# EAGLE design power_sense_shield (EAGLE 6.3)
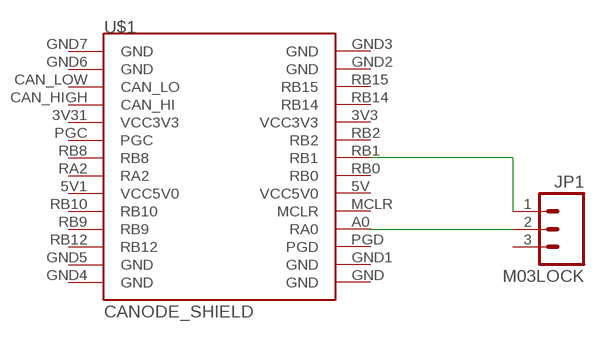
[diagram p0: schematic, sheet 1]

## Parts
JP1  M03LOCK  [1X03_LOCK]
U$1  CANODE_SHIELD  [CANODE_SHIELD]

## Nets
N$2: JP1.2 U$1.A0(RA0)
N$3 [small]: JP1.1 U$1.RB1
Unconnected: JP1.3 U$1.3V3(VCC3V3) U$1.3V31(VCC3V3) U$1.5V1(VCC5V0) U$1.5V(VCC5V0) U$1.CAN_HIGH(CAN_HI) U$1.CAN_LOW(CAN_LO) U$1.GND U$1.GND1(GND) U$1.GND2(GND) U$1.GND3(GND) U$1.GND4(GND) U$1.GND5(GND) U$1.GND6(GND) U$1.GND7(GND) U$1.MCLR U$1.PGC U$1.PGD U$1.RA2 U$1.RB0 U$1.RB2 U$1.RB8 U$1.RB9 U$1.RB10 U$1.RB12 U$1.RB14 U$1.RB15

## Library data of the parts
JP1 = ASL:M03: Header 3 Standard 3-pin 0.1" header. Use with straight break away headers (SKU : PRT-00116), right angle break away headers (PRT-00553), swiss pins (PRT-00743), machine pins (PRT-00117), and female headers (PRT-00115). Molex polarized connector foot print use with SKU : PRT-08232 with associated crimp pins and housings.
U$1 = ASL:CANODE_SHIELD: This part provides an outline of the CANode to facilitate developing shield boards. Note that this does not show the position of the mounting holes for the 4-40 screws, which should be .12" holes centered in the 4 circles in the corners.

## Net classes
1 power: width 0.762 mm
2 small: width 0.203 mm

## Board
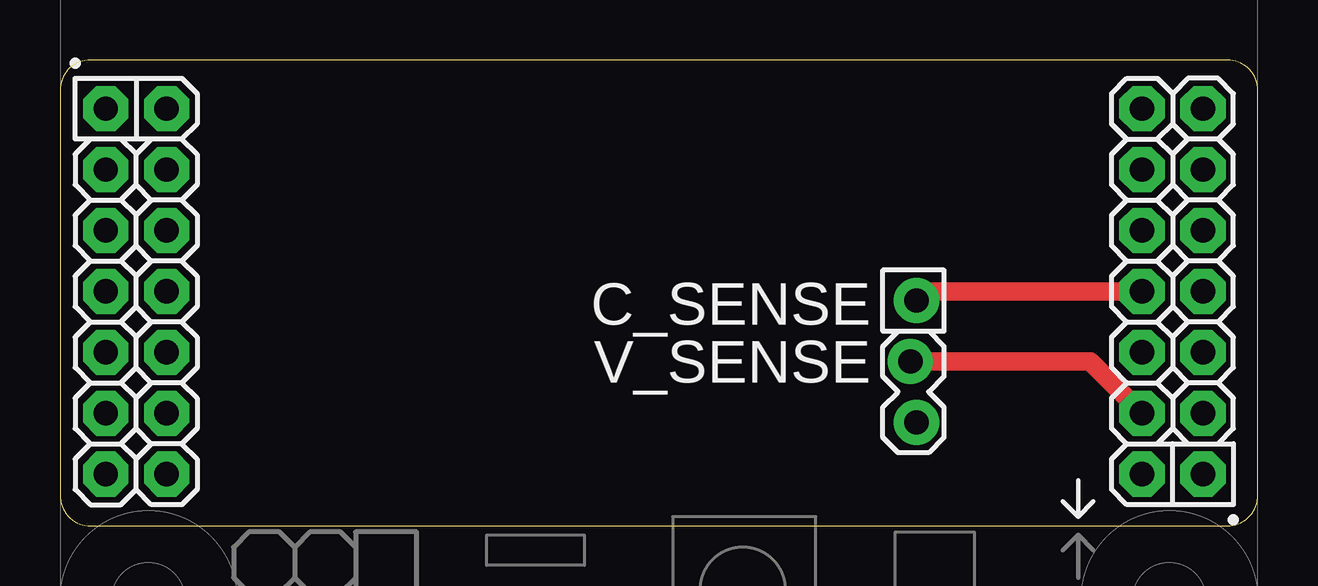
[diagram p1: board, top side]

Size 49.91 x 19.43 mm. Coordinates in mm from the lower left corner, seen from the top.
Outline: 0,18.16 0,1.27 arc90 1.27,0 48.64,0 arc90 49.91,1.27 49.91,18.16 arc90 48.64,19.43 1.27,19.43 arc90 0,18.16
Copper layers (1*16): Top 0.035mm / dielectric 1.5mm / Bottom 0.035mm
Design rules "default *": minimum track width 10mil, minimum drill 24mil, track to track 8mil, track to pad 8mil, pad to pad 8mil, via to via 8mil, smd to smd 8mil, copper to edge 30mil, drill to drill 8mil, minimum pad ring 10mil, minimum via ring 20mil, stop-mask expansion 4mil, vias tented up to drill 0mil, thermal gap 10mil

### Footprints (pad centres in the part's own frame; a part is rotated, then mirrored left to right if it is on the bottom)
1X03_LOCK = drill 1.016 pad 1.88: 1 0,0.127; 2 2.54,-0.127; 3 5.08,0.127
CANODE_SHIELD = drill 1.016 pad 1.88 octagon: 3V3 45.085,19.05; 3V31 4.445,13.97; 5V 45.085,13.97; 5V1 4.445,19.05; A0 45.085,11.43; CAN_HIGH 1.905,11.43; CAN_LOW 4.445,11.43; GND 45.085,24.13; GND1 47.625,24.13; GND2 45.085,8.89; GND3 47.625,8.89; GND4 4.445,8.89; GND5 1.905,8.89; GND6 4.445,24.13; GND7 1.905,24.13; MCLR 47.625,13.97; PGC 1.905,13.97; PGD 47.625,11.43; RA2 1.905,16.51; RB0 47.625,16.51; RB1 45.085,16.51; RB2 47.625,19.05; RB8 4.445,16.51; RB9 4.445,21.59; RB10 1.905,19.05; RB12 1.905,21.59; RB14 47.625,21.59; RB15 45.085,21.59

### Placement (x,y rotation side)
JP1  35.56,9.4 270 top
U$1  0,-6.73 0 top

### Tracks (layer width: path | path; a pad name or v marks a point on that pad's centre or on a via)
N$2
  Top 0.762: U$1.A0 42.93,6.86 JP1.2
N$3
  Top 0.762: JP1.1 36.07,9.78 U$1.RB1

### Text on the board
tPlace: C_SENSE | V_SENSE